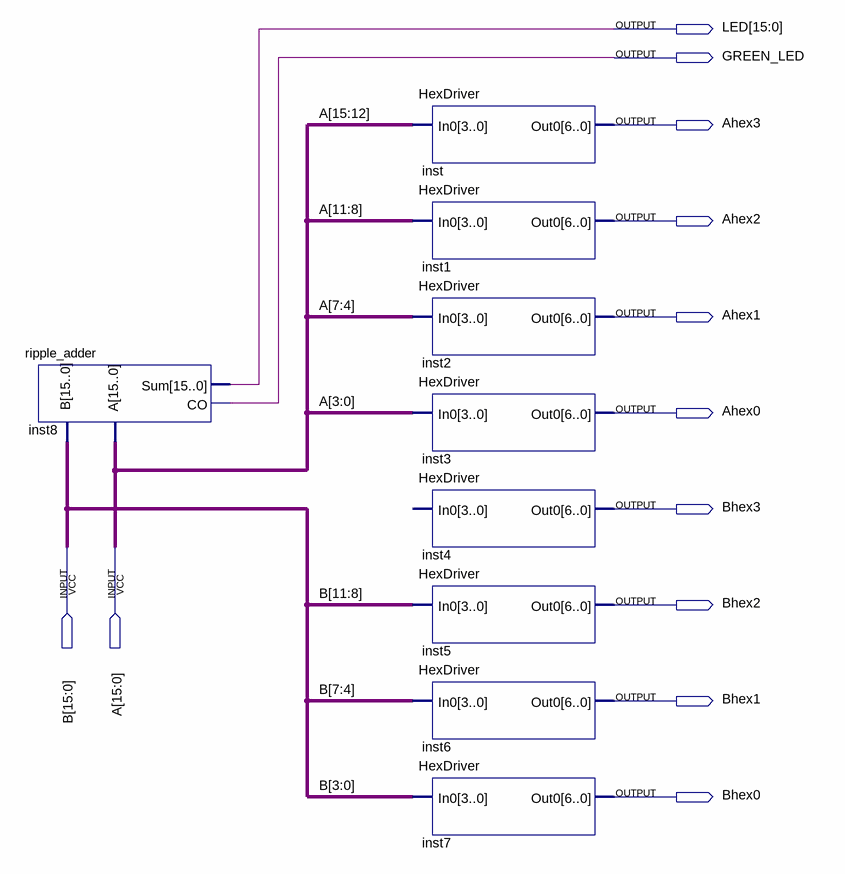
[diagram p0: schematic sheet]
// Quartus schematic ripple.bdf as structural Verilog: 9 symbols, 12 pins
module ripple (
  input  [15:0] B,
  input  [15:0] A,
  output [15:0] LED,
  output GREEN_LED,
  output Ahex3,
  output Ahex2,
  output Ahex1,
  output Ahex0,
  output Bhex3,
  output Bhex2,
  output Bhex1,
  output Bhex0
);

  ripple_adder inst8 (.A(A), .B(B), .Sum(LED), .CO(GREEN_LED));
  HexDriver inst (.In0(A[15:12]), .Out0(Ahex3));
  HexDriver inst1 (.In0(A[11:8]), .Out0(Ahex2));
  HexDriver inst2 (.In0(A[7:4]), .Out0(Ahex1));
  HexDriver inst3 (.In0(A[3:0]), .Out0(Ahex0));
  HexDriver inst4 (.Out0(Bhex3));  // open: In0
  HexDriver inst5 (.In0(B[11:8]), .Out0(Bhex2));
  HexDriver inst6 (.In0(B[7:4]), .Out0(Bhex1));
  HexDriver inst7 (.In0(B[3:0]), .Out0(Bhex0));
endmodule
